# Altium schematic sheet Power Regulation.SchDoc
size A4
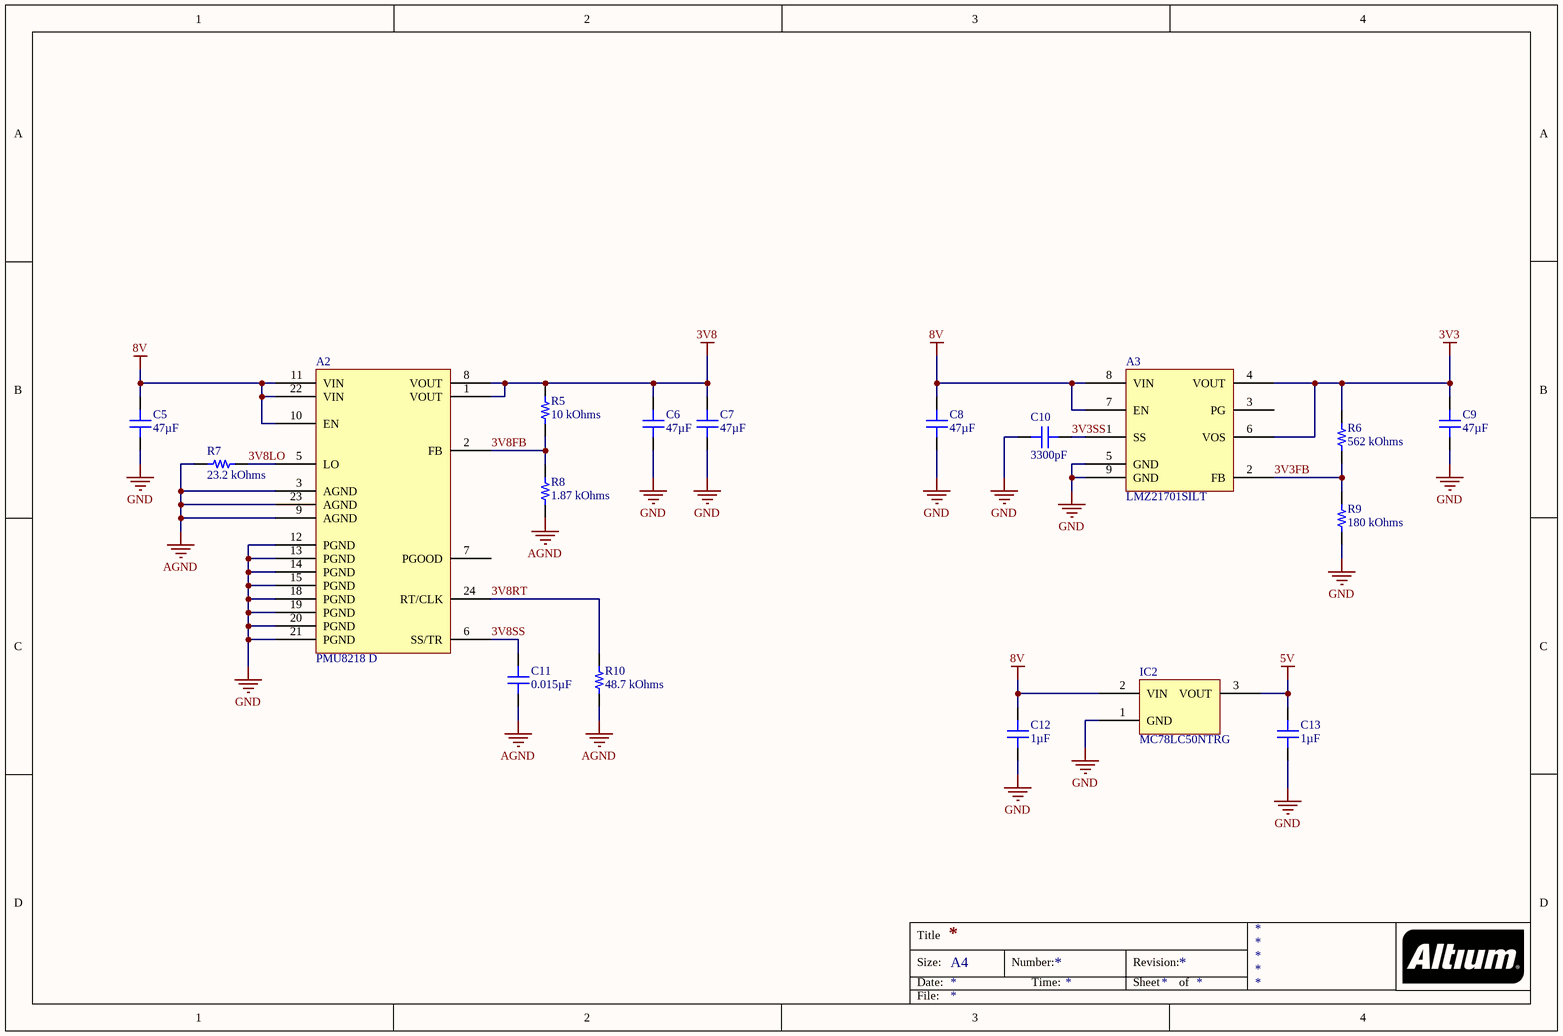
[diagram p0: Power Regulation.SchDoc]

## Parts
A2  PMU8218 D  [FLEX QFM-24 MOL]
A3  LMZ21701SILT  [TI MICROSIP-8 SIL0008E]
C5  47µF  [CAP 1210_3225 - 2.8MM]
C6  47µF  [CAP 1210_3225 - 2.8MM]
C7  47µF  [CAP 1210_3225 - 2.8MM]
C8  47µF  [CAP 1210_3225 - 2.8MM]
C9  47µF  [CAP 1210_3225 - 2.8MM]
C10  3300pF  [CAP 0201_0603]
C11  0.015µF  [CAP 0201_0603]
C12  1µF  [CAP 0402_1005]
C13  1µF  [CAP 0402_1005]
IC2  MC78LC50NTRG  [ON SEMI TSOT-23-5 419AE]
R5  10 kOhms  [RES 0201_0603]
R6  562 kOhms  [RES 0201_0603]
R7  23.2 kOhms  [RES 0201_0603]
R8  1.87 kOhms  [RES 0201_0603]
R9  180 kOhms  [RES 0201_0603]
R10  48.7 kOhms  [RES 0201_0603]

## Nets
3V3: A3.4(VOUT) A3.6(VOS) C9.2 R6.2
3V8: A2.1(VOUT) A2.8(VOUT) C6.2 C7.2 R5.2
5V: C13.2 IC2.3(VOUT)
8V: A2.10(EN) A2.11(VIN) A2.22(VIN) A3.7(EN) A3.8(VIN) C5.2 C8.2 C12.2 IC2.2(VIN)
AGND: A2.3(AGND) A2.9(AGND) A2.23(AGND) C11.1 R7.1 R8.1 R10.1
GND: A2.12(PGND) A2.13(PGND) A2.14(PGND) A2.15(PGND) A2.18(PGND) A2.19(PGND) A2.20(PGND) A2.21(PGND) A3.5(GND) A3.9(GND) C5.1 C6.1 C7.1 C8.1 C9.1 C10.1 C12.1 C13.1 IC2.1(GND) R9.1
3V3FB: A3.2(FB) R6.1 R9.2
3V3SS: A3.1(SS) C10.2
3V8FB: A2.2(FB) R5.1 R8.2
3V8LO: A2.5(LO) R7.2
3V8RT: A2.24(RT/CLK) R10.2
3V8SS: A2.6(SS/TR) C11.2

Not connected (* = marked no-connect by the designer): A2 7(PGOOD); A3 3(PG)

## Notes on the sheet
- Title
- Size:
- Date:
- A4
- Number:
- Time:
- Revision:
- Sheet
- of
- File:

## Library data of the parts
A2 = PMU8218 D: ANALOG POL; 4.5-17VIN; 0.6-5.5VO; Manufacturer: Flex Power Modules; Control Features: Enable, Active High; Current - Output (Max): 4A; Efficiency: 88.5%; Number of Outputs: 1; Power (Watts): 22W; Voltage - Input (Max): 17V; Voltage - Input (Min): 4.5V; Voltage - Output 1: 0.6 ~ 5.5V; Part Number: PMU8218 D; Applications: ITE (Commercial); ComponentLink1Description: Datasheet; ComponentLink1URL: https://flex.com/-/media/Project/Flex/BrandSite/technology/power/power_modules/Analog_POL/FPM-TechSpec-PMU-product-series-RevB.pdf; ComponentLink2Description: DigiKey Link; ComponentLink2URL: http://digikey.com/product-detail/en/flex-power-modules/PMU8218-D/2166-PMU8218DCT-ND/11581978; Device Package: 24-SMD Module; Features: Adjustable Output, Remote On/Off; LastUpdated: 04/04/2020 18:59:44; Lifecycle Status: Active; Minimum Order: 1; Mounting Type: Surface Mount; Operating Temperature: -40°C ~ 125°C; Package / Case: 24-SMD Module; Packaging: Unknown; PartId: 24; Part Status: Active; Price: 4.46; Series: PMU8000; Size / Dimension: 0.30" L x 0.30" W x 0.21" H (7.5mm x 7.5mm x 5.4mm); Supplier 1: DigiKey; Supplier Part Number 1: 2166-PMU8218DCT-ND; Type: Non-Isolated PoL Module
A3 = LMZ21701SILT: DC DC CONVERTER 0.9-6V 6W; Manufacturer: Texas Instruments; Control Features: Enable, Active High; Current - Output (Max): 1A; Efficiency: 95%; Number of Outputs: 1; Voltage - Input (Max): 17V; Voltage - Input (Min): 3V; Voltage - Output 1: 0.9 ~ 6V; Part Number: LMZ21701SILT; Applications: ITE (Commercial); ComponentLink1Description: Datasheet; ComponentLink1URL: http://www.ti.com/general/docs/suppproductinfo.tsp?distId=10&gotoUrl=http%3A%2F%2Fwww.ti.com%2Flit%2Fgpn%2Flmz21701; ComponentLink2Description: DigiKey Link; ComponentLink2URL: //digikey.com/product-detail/en/texas-instruments/LMZ21701SILT/296-38545-2-ND/5034142; Device Package: 8-SMD Module; Features: OCP, OTP, SCP, UVLO; LastUpdated: 12/12/2019 07:43:20; Lifecycle Status: 0; Minimum Order: 1; Mounting Type: Surface Mount; Operating Temperature: -40°C ~ 125°C; Package / Case: 8-SMD Module; Packaging: TapeAndReel; PartId: 15; Part Status: Active; Price: 2.94; Series: SIMPLE SWITCHER® Nano; Size / Dimension: 0.14" L x 0.14" W x 0.07" H (3.5mm x 3.5mm x 1.8mm); Supplier 1: DigiKey; Supplier Part Number 1: 296-38545-2-ND; Type: Non-Isolated PoL Module
C5-C9 = LMK325B7476MM-PR: CAP CER 47UF 10V X7R 1210; Manufacturer: Taiyo Yuden; Tolerance: ±20%; Part Number: LMK325B7476MM-PR; Value: 47µF; Applications: General Purpose; Capacitance: 47µF; ComponentLink1Description: Datasheet; ComponentLink1URL: https://www.yuden.co.jp/productdata/catalog/mlcc01_e.pdf; ComponentLink2Description: DigiKey Link; ComponentLink2URL: http://digikey.com/product-detail/en/taiyo-yuden/LMK325B7476MM-PR/587-5922-1-ND/7675042; Device Package: 1210 (3225 Metric); LastUpdated: 21/01/2020 00:30:21; Lifecycle Status: Active; Minimum Order: 1; Mounting Type: Surface Mount, MLCC; Operating Temperature: -55°C ~ 125°C; Package / Case: 1210 (3225 Metric); Packaging: TapeAndReel; PartId: 24091; Part Status: Active; Price: 0.28; Series: M; Size / Dimension: 0.126" L x 0.098" W (3.20mm x 2.50mm); Supplier 1: DigiKey; Supplier Part Number 1: 587-5922-1-ND; Temperature Coefficient: X7R; Thickness (Max): 0.106" (2.70mm); Voltage - Rated: 10V
C10 = GRM033R70J332KA01D: CAP CER 3300PF 6.3V X7R 0201; Manufacturer: Murata Electronics; Tolerance: ±10%; Part Number: GRM033R70J332KA01D; Value: 3300pF; Applications: General Purpose; Capacitance: 3300pF; ComponentLink1Description: Datasheet; ComponentLink1URL: https://www.murata.com/~/media/webrenewal/support/library/catalog/products/capacitor/mlcc/c02e.ashx?la=en-us; ComponentLink2Description: DigiKey Link; ComponentLink2URL: http://digikey.com/product-detail/en/murata-electronics/GRM033R70J332KA01D/490-8158-1-ND/4380451; Device Package: 0201 (0603 Metric); LastUpdated: 21/01/2020 00:00:13; Lifecycle Status: Active; Minimum Order: 1; Mounting Type: Surface Mount, MLCC; Operating Temperature: -55°C ~ 125°C; Package / Case: 0201 (0603 Metric); Packaging: CutTape; PartId: 1379; Part Status: Active; Price: 0.10; Series: GRM; Size / Dimension: 0.024" L x 0.012" W (0.60mm x 0.30mm); Supplier 1: DigiKey; Supplier Part Number 1: 490-8158-1-ND; Temperature Coefficient: X7R; Thickness (Max): 0.013" (0.33mm); Voltage - Rated: 6.3V
C11 = CC0201KRX5R5BB153: CAP CER 0.015UF 6.3V X5R 0201; Manufacturer: Yageo; Tolerance: ±10%; Part Number: CC0201KRX5R5BB153; Value: 0.015µF; Applications: General Purpose; Capacitance: 0.015µF; ComponentLink1Description: Datasheet; ComponentLink1URL: https://www.yageo.com/upload/media/product/productsearch/datasheet/mlcc/UPY-GPHC_X5R_4V-to-50V_25.pdf; ComponentLink2Description: DigiKey Link; ComponentLink2URL: http://digikey.com/product-detail/en/yageo/CC0201KRX5R5BB153/311-3686-1-ND/8024775; Device Package: 0201 (0603 Metric); LastUpdated: 21/01/2020 00:00:12; Lifecycle Status: Active; Minimum Order: 1; Mounting Type: Surface Mount, MLCC; Operating Temperature: -55°C ~ 85°C; Package / Case: 0201 (0603 Metric); Packaging: TapeAndReel; PartId: 1637; Part Status: Active; Price: 0.01; Series: CC; Size / Dimension: 0.024" L x 0.012" W (0.60mm x 0.30mm); Supplier 1: DigiKey; Supplier Part Number 1: 311-3686-1-ND; Temperature Coefficient: X5R; Thickness (Max): 0.013" (0.33mm); Voltage - Rated: 6.3V
C12 C13 = GRM155R61C105MA12D: CAP CER 1UF 16V X5R 0402; Manufacturer: Murata Electronics; Tolerance: ±20%; Part Number: GRM155R61C105MA12D; Value: 1µF; Applications: General Purpose; Capacitance: 1µF; ComponentLink1Description: Datasheet; ComponentLink1URL: https://search.murata.co.jp/Ceramy/image/img/A01X/G101/ENG/GRM155R61C105MA12-01.pdf; ComponentLink2Description: DigiKey Link; ComponentLink2URL: http://digikey.com/product-detail/en/murata-electronics/GRM155R61C105MA12D/490-14599-1-ND/6606205; Device Package: 0402 (1005 Metric); LastUpdated: 01/04/2020 23:56:41; Lifecycle Status: Active; Minimum Order: 1; Mounting Type: Surface Mount, MLCC; Operating Temperature: -55°C ~ 85°C; Package / Case: 0402 (1005 Metric); Packaging: TapeAndReel; PartId: 10295; Part Status: Active; Price: 0.01; Series: GRM; Size / Dimension: 0.039" L x 0.020" W (1.00mm x 0.50mm); Supplier 1: DigiKey; Supplier Part Number 1: 490-14599-1-ND; Temperature Coefficient: X5R; Thickness (Max): 0.022" (0.55mm); Voltage - Rated: 16V
IC2 = MC78LC50NTRG: IC REG LINEAR 5V 100MA 5TSOP; Manufacturer: ON Semiconductor; Current - Quiescent (Iq): 3.6µA; Number of Regulators: 1; Output Configuration: Positive; Output Type: Fixed; Voltage Dropout (Max): 0.038V @ 1mA; Voltage - Input (Max): 12V; Part Number: MC78LC50NTRG; ComponentLink1Description: Datasheet; ComponentLink1URL: http://www.onsemi.com/pub/Collateral/MC78LC00-D.PDF; ComponentLink2Description: DigiKey Link; ComponentLink2URL: http://digikey.com/product-detail/en/on-semiconductor/MC78LC50NTRG/MC78LC50NTRGOSCT-ND/1139754; Current - Output: 100mA; Device Package: SOT-23-5 Thin, TSOT-23-5; LastUpdated: 21/01/2020 03:58:44; Lifecycle Status: Active; Minimum Order: 1; Mounting Type: Surface Mount; Operating Temperature: -40°C ~ 85°C; Package / Case: SOT-23-5 Thin, TSOT-23-5; Packaging: TapeAndReel; Part Status: Active; Price: 0.28; Series: -; Supplier 1: DigiKey; Supplier Part Number 1: MC78LC50NTRGOSCT-ND; Supplier Device Package: 5-TSOP; Voltage - Output (Min/Fixed): 5V
R5 = ERJ-1GNF1002C: RES SMD 10K OHM 1% 1/20W 0201; Manufacturer: Panasonic Electronic Components; Power (Watts): 0.05W, 1/20W; Temperature Coefficient: ±200ppm/°C; Part Number: ERJ-1GNF1002C; Value: 10 kOhms; ComponentLink1Description: Datasheet; ComponentLink1URL: https://industrial.panasonic.com/cdbs/www-data/pdf/RDA0000/AOA0000C304.pdf; ComponentLink2Description: DigiKey Link; ComponentLink2URL: http://digikey.com/product-detail/en/panasonic-electronic-components/ERJ-1GNF1002C/P122414CT-ND/7389440; Composition: Thick Film; Device Package: 0201 (0603 Metric); Features: Automotive AEC-Q200; Height - Seated (Max): 0.010" (0.26mm); LastUpdated: 21/01/2020 00:04:13; Lifecycle Status: Active; Minimum Order: 1; Number of Terminations: 2; Operating Temperature: -55°C ~ 125°C; Package / Case: 0201 (0603 Metric); Packaging: TapeAndReel; PartId: 2296; Part Status: Active; Price: 0.01; Ratings: AEC-Q200; Resistance: 10 kOhms; Series: ERJ; Size / Dimension: 0.024" L x 0.012" W (0.60mm x 0.30mm); Supplier 1: DigiKey; Supplier Part Number 1: P122414CT-ND; Supplier Device Package: 0201; Tolerance: ±1%
R6 = ERJ-1GNF5623C: RES SMD 562K OHM 1% 1/20W 0201; Manufacturer: Panasonic Electronic Components; Power (Watts): 0.05W, 1/20W; Temperature Coefficient: ±200ppm/°C; Part Number: ERJ-1GNF5623C; Value: 562 kOhms; ComponentLink1Description: Datasheet; ComponentLink1URL: https://industrial.panasonic.com/cdbs/www-data/pdf/RDA0000/AOA0000C304.pdf; ComponentLink2Description: DigiKey Link; ComponentLink2URL: http://digikey.com/product-detail/en/panasonic-electronic-components/ERJ-1GNF5623C/P123081CT-ND/8343101; Composition: Thick Film; Device Package: 0201 (0603 Metric); Features: Automotive AEC-Q200; Height - Seated (Max): 0.010" (0.26mm); LastUpdated: 21/01/2020 00:04:13; Lifecycle Status: Active; Minimum Order: 1; Number of Terminations: 2; Operating Temperature: -55°C ~ 125°C; Package / Case: 0201 (0603 Metric); Packaging: TapeAndReel; PartId: 2605; Part Status: Active; Price: 0.01; Ratings: AEC-Q200; Resistance: 562 kOhms; Series: ERJ; Size / Dimension: 0.024" L x 0.012" W (0.60mm x 0.30mm); Supplier 1: DigiKey; Supplier Part Number 1: P123081CT-ND; Supplier Device Package: 0201; Tolerance: ±1%
R7 = ERJ-1GNF2322C: RES SMD 23.2K OHM 1% 1/20W 0201; Manufacturer: Panasonic Electronic Components; Power (Watts): 0.05W, 1/20W; Temperature Coefficient: ±200ppm/°C; Part Number: ERJ-1GNF2322C; Value: 23.2 kOhms; ComponentLink1Description: Datasheet; ComponentLink1URL: https://industrial.panasonic.com/cdbs/www-data/pdf/RDA0000/AOA0000C304.pdf; ComponentLink2Description: DigiKey Link; ComponentLink2URL: http://digikey.com/product-detail/en/panasonic-electronic-components/ERJ-1GNF2322C/P122848CT-ND/8342635; Composition: Thick Film; Device Package: 0201 (0603 Metric); Features: Automotive AEC-Q200; Height - Seated (Max): 0.010" (0.26mm); LastUpdated: 21/01/2020 00:04:13; Lifecycle Status: Active; Minimum Order: 1; Number of Terminations: 2; Operating Temperature: -55°C ~ 125°C; Package / Case: 0201 (0603 Metric); Packaging: TapeAndReel; PartId: 2324; Part Status: Active; Price: 0.01; Ratings: AEC-Q200; Resistance: 23.2 kOhms; Series: ERJ; Size / Dimension: 0.024" L x 0.012" W (0.60mm x 0.30mm); Supplier 1: DigiKey; Supplier Part Number 1: P122848CT-ND; Supplier Device Package: 0201; Tolerance: ±1%
R8 = ERJ-1GNF1871C: RES SMD 1.87K OHM 1% 1/20W 0201; Manufacturer: Panasonic Electronic Components; Power (Watts): 0.05W, 1/20W; Temperature Coefficient: ±200ppm/°C; Part Number: ERJ-1GNF1871C; Value: 1.87 kOhms; ComponentLink1Description: Datasheet; ComponentLink1URL: https://industrial.panasonic.com/cdbs/www-data/pdf/RDA0000/AOA0000C304.pdf; ComponentLink2Description: DigiKey Link; ComponentLink2URL: http://digikey.com/product-detail/en/panasonic-electronic-components/ERJ-1GNF1871C/P122796CT-ND/8342531; Composition: Thick Film; Device Package: 0201 (0603 Metric); Features: Automotive AEC-Q200; Height - Seated (Max): 0.010" (0.26mm); LastUpdated: 21/01/2020 00:04:11; Lifecycle Status: Active; Minimum Order: 1; Number of Terminations: 2; Operating Temperature: -55°C ~ 125°C; Package / Case: 0201 (0603 Metric); Packaging: TapeAndReel; PartId: 3542; Part Status: Active; Price: 0.01; Ratings: AEC-Q200; Resistance: 1.87 kOhms; Series: ERJ; Size / Dimension: 0.024" L x 0.012" W (0.60mm x 0.30mm); Supplier 1: DigiKey; Supplier Part Number 1: P122796CT-ND; Supplier Device Package: 0201; Tolerance: ±1%
R9 = ERJ-1GNF1803C: RES SMD 180K OHM 1% 1/20W 0201; Manufacturer: Panasonic Electronic Components; Power (Watts): 0.05W, 1/20W; Temperature Coefficient: ±200ppm/°C; Part Number: ERJ-1GNF1803C; Value: 180 kOhms; ComponentLink1Description: Datasheet; ComponentLink1URL: https://industrial.panasonic.com/cdbs/www-data/pdf/RDA0000/AOA0000C304.pdf; ComponentLink2Description: DigiKey Link; ComponentLink2URL: http://digikey.com/product-detail/en/panasonic-electronic-components/ERJ-1GNF1803C/P122790CT-ND/8342519; Composition: Thick Film; Device Package: 0201 (0603 Metric); Features: Automotive AEC-Q200; Height - Seated (Max): 0.010" (0.26mm); LastUpdated: 21/01/2020 00:04:10; Lifecycle Status: Active; Minimum Order: 1; Number of Terminations: 2; Operating Temperature: -55°C ~ 125°C; Package / Case: 0201 (0603 Metric); Packaging: TapeAndReel; PartId: 4229; Part Status: Active; Price: 0.01; Ratings: AEC-Q200; Resistance: 180 kOhms; Series: ERJ; Size / Dimension: 0.024" L x 0.012" W (0.60mm x 0.30mm); Supplier 1: DigiKey; Supplier Part Number 1: P122790CT-ND; Supplier Device Package: 0201; Tolerance: ±1%
R10 = ERJ-1GNF4872C: RES SMD 48.7K OHM 1% 1/20W 0201; Manufacturer: Panasonic Electronic Components; Power (Watts): 0.05W, 1/20W; Temperature Coefficient: ±200ppm/°C; Part Number: ERJ-1GNF4872C; Value: 48.7 kOhms; ComponentLink1Description: Datasheet; ComponentLink1URL: https://industrial.panasonic.com/cdbs/www-data/pdf/RDA0000/AOA0000C304.pdf; ComponentLink2Description: DigiKey Link; ComponentLink2URL: http://digikey.com/product-detail/en/panasonic-electronic-components/ERJ-1GNF4872C/P123042CT-ND/8343023; Composition: Thick Film; Device Package: 0201 (0603 Metric); Features: Automotive AEC-Q200; Height - Seated (Max): 0.010" (0.26mm); LastUpdated: 21/01/2020 00:04:10; Lifecycle Status: Active; Minimum Order: 1; Number of Terminations: 2; Operating Temperature: -55°C ~ 125°C; Package / Case: 0201 (0603 Metric); Packaging: TapeAndReel; PartId: 4173; Part Status: Active; Price: 0.01; Ratings: AEC-Q200; Resistance: 48.7 kOhms; Series: ERJ; Size / Dimension: 0.024" L x 0.012" W (0.60mm x 0.30mm); Supplier 1: DigiKey; Supplier Part Number 1: P123042CT-ND; Supplier Device Package: 0201; Tolerance: ±1%